# Altium schematic sheet VideoFiltering.SchDoc
size B; SheetNumber: 4; SheetTotal: 8
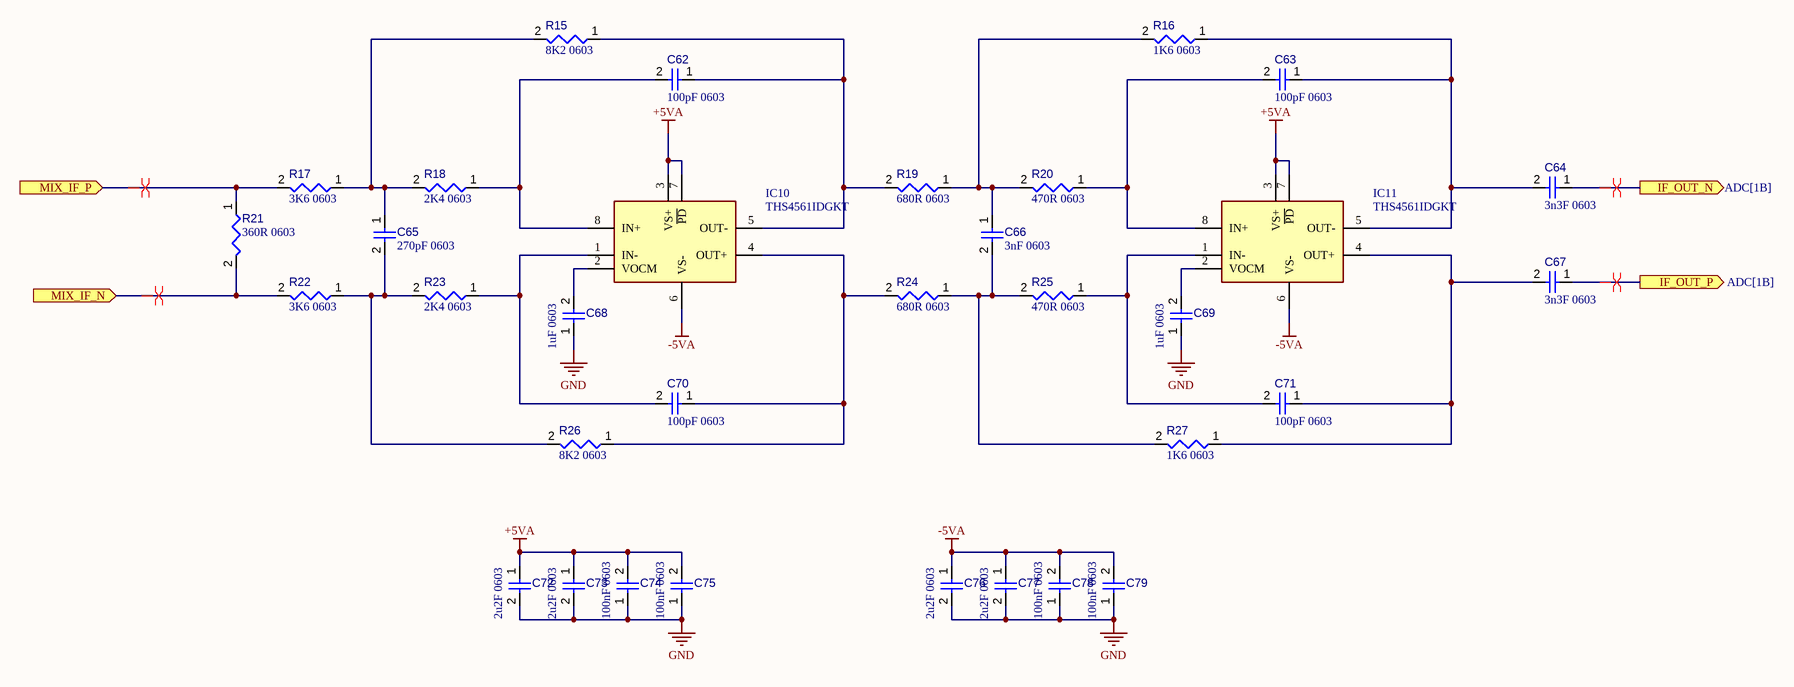
[diagram p0: VideoFiltering.SchDoc]

## Parts
C62  value 100pF 0603  [CAPC0603(1608)100_L]  (hidden comment: Capacitor 1µF +/-0.1% 25V 0603)
C63  value 100pF 0603  [CAPC0603(1608)100_L]  (hidden comment: Capacitor 1µF +/-0.1% 25V 0603)
C64  value 3n3F 0603  [CAPC0603(1608)100_L]  (hidden comment: Capacitor 1µF +/-0.1% 25V 0603)
C65  value 270pF 0603  [CAPC0603(1608)100_L]  (hidden comment: Capacitor 1µF +/-0.1% 25V 0603)
C66  value 3nF 0603  [CAPC0603(1608)100_L]  (hidden comment: Capacitor 1µF +/-0.1% 25V 0603)
C67  value 3n3F 0603  [CAPC0603(1608)100_L]  (hidden comment: Capacitor 1µF +/-0.1% 25V 0603)
C68  value 1uF 0603  [CAPC0603(1608)100_L]  (hidden comment: Capacitor 1µF +/-0.1% 25V 0603)
C69  value 1uF 0603  [CAPC0603(1608)100_L]  (hidden comment: Capacitor 1µF +/-0.1% 25V 0603)
C70  value 100pF 0603  [CAPC0603(1608)100_L]  (hidden comment: Capacitor 1µF +/-0.1% 25V 0603)
C71  value 100pF 0603  [CAPC0603(1608)100_L]  (hidden comment: Capacitor 1µF +/-0.1% 25V 0603)
C72  value 2u2F 0603  [CAPC0603(1608)100_L]  (hidden comment: Capacitor 1µF +/-0.1% 25V 0603)
C73  value 2u2F 0603  [CAPC0603(1608)100_L]  (hidden comment: Capacitor 1µF +/-0.1% 25V 0603)
C74  value 100nF 0603  [CAPC0603(1608)100_L]  (hidden comment: Capacitor 1µF +/-0.1% 25V 0603)
C75  value 100nF 0603  [CAPC0603(1608)100_L]  (hidden comment: Capacitor 1µF +/-0.1% 25V 0603)
C76  value 2u2F 0603  [CAPC0603(1608)100_L]  (hidden comment: Capacitor 1µF +/-0.1% 25V 0603)
C77  value 2u2F 0603  [CAPC0603(1608)100_L]  (hidden comment: Capacitor 1µF +/-0.1% 25V 0603)
C78  value 100nF 0603  [CAPC0603(1608)100_L]  (hidden comment: Capacitor 1µF +/-0.1% 25V 0603)
C79  value 100nF 0603  [CAPC0603(1608)100_L]  (hidden comment: Capacitor 1µF +/-0.1% 25V 0603)
IC10  THS4561IDGKT  [SOP65P490X110-8N]
IC11  THS4561IDGKT  [SOP65P490X110-8N]
R15  value 8K2 0603  [RESC0603(1608)_L]  (hidden comment: 120R3J)
R16  value 1K6 0603  [RESC0603(1608)_L]  (hidden comment: 120R3J)
R17  value 3K6 0603  [RESC0603(1608)_L]  (hidden comment: 120R3J)
R18  value 2K4 0603  [RESC0603(1608)_L]  (hidden comment: 120R3J)
R19  value 680R 0603  [RESC0603(1608)_L]  (hidden comment: 120R3J)
R20  value 470R 0603  [RESC0603(1608)_L]  (hidden comment: 120R3J)
R21  value 360R 0603  [RESC0603(1608)_L]  (hidden comment: 120R3J)
R22  value 3K6 0603  [RESC0603(1608)_L]  (hidden comment: 120R3J)
R23  value 2K4 0603  [RESC0603(1608)_L]  (hidden comment: 120R3J)
R24  value 680R 0603  [RESC0603(1608)_L]  (hidden comment: 120R3J)
R25  value 470R 0603  [RESC0603(1608)_L]  (hidden comment: 120R3J)
R26  value 8K2 0603  [RESC0603(1608)_L]  (hidden comment: 120R3J)
R27  value 1K6 0603  [RESC0603(1608)_L]  (hidden comment: 120R3J)

## Ports
IF_OUT_N (out, see ADC[1B]), IF_OUT_P (out, see ADC[1B]), MIX_IF_N (in, see Mixer[6B]), MIX_IF_P (in, see Mixer[6C])

## Nets
+5VA: C72.1 C73.1 C74.2 C75.2 IC10.3(VS+) IC10.7(~{PD}) IC11.3(VS+) IC11.7(~{PD})
-5VA: C76.1 C77.1 C78.2 C79.2 IC10.6(VS-) IC11.6(VS-)
GND: C68.1 C69.1 C72.2 C73.2 C74.1 C75.1 C76.2 C77.2 C78.1 C79.1
IF_OUT_N: C64.1 ; port IF_OUT_N
IF_OUT_P: C67.1 ; port IF_OUT_P
MIX_IF_N: R21.2 R22.2 ; port MIX_IF_N
MIX_IF_P: R17.2 R21.1 ; port MIX_IF_P
NetC62_1: C62.1 IC10.5(OUT-) R15.1 R19.2
NetC62_2: C62.2 IC10.8(IN+) R18.1
NetC63_1: C63.1 C64.2 IC11.5(OUT-) R16.1
NetC63_2: C63.2 IC11.8(IN+) R20.1
NetC65_1: C65.1 R15.2 R17.1 R18.2
NetC65_2: C65.2 R22.1 R23.2 R26.2
NetC66_1: C66.1 R16.2 R19.1 R20.2
NetC66_2: C66.2 R24.1 R25.2 R27.2
NetC67_2: C67.2 C71.1 IC11.4(OUT+) R27.1
NetC68_2: C68.2 IC10.2(VOCM)
NetC69_2: C69.2 IC11.2(VOCM)
NetC70_1: C70.1 IC10.4(OUT+) R24.2 R26.1
NetC70_2: C70.2 IC10.1(IN-) R23.1
NetC71_2: C71.2 IC11.1(IN-) R25.1

## Layout directives
differential pair: IF_OUT_N, IF_OUT_P, MIX_IF_N, MIX_IF_P

## Library data of the parts
C62 C63 C70 C71 = CMP-001-00055-4: Chip Capacitor, 1µF +/-0.1%, 25V, 0603, Thickness 1 mm; Manufacturer Part No: 06033A101GAT2A; Tolerance: 20%; Min Operating Temperature: -55°C; Max Operating Temperature: 85°C; Voltage Rating: 25V; Mounting Technology: SMT; Case/Package: 0603; Pins: 2; Mouser Part No: 581-06033A101GAT2A
C64 C67 = CMP-001-00055-4: Chip Capacitor, 1µF +/-0.1%, 25V, 0603, Thickness 1 mm; Manufacturer Part No: VJ0603Y332JXBAC; Tolerance: 20%; Min Operating Temperature: -55°C; Max Operating Temperature: 85°C; Voltage Rating: 25V; Mounting Technology: SMT; Case/Package: 0603; Pins: 2; Mouser Part No: 77-VJ0603Y332JXBAC
C65 = CMP-001-00055-4: Chip Capacitor, 1µF +/-0.1%, 25V, 0603, Thickness 1 mm; Manufacturer Part No: C0603C271J1GACAUTO; Tolerance: 20%; Min Operating Temperature: -55°C; Max Operating Temperature: 85°C; Voltage Rating: 25V; Mounting Technology: SMT; Case/Package: 0603; Pins: 2; Mouser Part No: 80-C0603C271J1GAUTO
C66 = CMP-001-00055-4: Chip Capacitor, 1µF +/-0.1%, 25V, 0603, Thickness 1 mm; Manufacturer Part No: C0603C302K5GACTU; Tolerance: 20%; Min Operating Temperature: -55°C; Max Operating Temperature: 85°C; Voltage Rating: 25V; Mounting Technology: SMT; Case/Package: 0603; Pins: 2; Mouser Part No: 80-C0603C302K5G
C68 C69 = CMP-001-00055-4: Chip Capacitor, 1µF +/-0.1%, 25V, 0603, Thickness 1 mm; Manufacturer Part No: 0603YC105KAZ2A; Tolerance: 20%; Min Operating Temperature: -55°C; Max Operating Temperature: 85°C; Voltage Rating: 25V; Mounting Technology: SMT; Case/Package: 0603; Pins: 2; Mouser Part No: 581-0603YC105KAZ2A
C72 C73 C76 C77 = CMP-001-00055-4: Multilayer Ceramic Capacitors MLCC - SMD/SMT 0603 10nF 16volts X7R 10%; Manufacturer Part No: VJ0603G225KXQCW1BC; Tolerance: 20%; Min Operating Temperature: -55°C; Max Operating Temperature: 85°C; Voltage Rating: 25V; Mounting Technology: SMT; Case/Package: 0603; Pins: 2; Mouser Part No: 77-VJ0603G225KXQCWBC
C74 C75 C78 C79 = CMP-001-00055-4: Chip Capacitor, 1µF +/-0.1%, 25V, 0603, Thickness 1 mm; Manufacturer Part No: 0603X104K250CT; Tolerance: 20%; Min Operating Temperature: -55°C; Max Operating Temperature: 85°C; Voltage Rating: 25V; Mounting Technology: SMT; Case/Package: 0603; Pins: 2; Mouser Part No: 791-0603X104K250CT
IC10 IC11 = THS4561IDGKT: Integrated Circuit; Manufacturer_Name: Texas Instruments; Datasheet Link: http://www.ti.com/general/docs/suppproductinfo.tsp?distId=10&gotoUrl=http%3A%2F%2Fwww.ti.com%2Flit%2Fgpn%2Fths4561; Height: 1.1mm; Manufacturer Part No: THS4561IDGKT; Mouser Part No: 595-THS4561IDGKT; Mouser Price/Stock: https://www.mouser.co.uk/ProductDetail/Texas-Instruments/THS4561IDGKT?qs=YCa%2FAAYMW01gTL9xVldK5g%3D%3D
R15 R26 = CMP-009-00069-2: Thick Film Resistors - SMD WRIS-RSKS 100 Ohms 1 % 0.1 W 0603 AEC-Q200; Manufacturer Part No: CR0603-FX-8201ELF; Power: 100mW; Tolerance: 5%; Mounting Technology: SMT; Case/Package: 0603; Pins: 2; Mouser Part No: 652-CR0603FX-8201ELF
R16 R27 = CMP-009-00069-2: Thick Film Resistors - SMD WRIS-RSKS 100 Ohms 1 % 0.1 W 0603 AEC-Q200; Manufacturer Part No: RT0603BRE071K6L; Power: 100mW; Tolerance: 5%; Mounting Technology: SMT; Case/Package: 0603; Pins: 2; Mouser Part No: 603-RT0603BRE071K6L
R17 R22 = CMP-009-00069-2: Thick Film Resistors - SMD WRIS-RSKS 100 Ohms 1 % 0.1 W 0603 AEC-Q200; Manufacturer Part No: CRCW06033K60FKTA; Power: 100mW; Tolerance: 5%; Mounting Technology: SMT; Case/Package: 0603; Pins: 2; Mouser Part No: 71-CRCW0603-3.6K
R18 R23 = CMP-009-00069-2: Thick Film Resistors - SMD WRIS-RSKS 100 Ohms 1 % 0.1 W 0603 AEC-Q200; Manufacturer Part No: RC0603FR-7W2K4L; Power: 100mW; Tolerance: 5%; Mounting Technology: SMT; Case/Package: 0603; Pins: 2; Mouser Part No: 603-RC0603FR-7W2K4L
R19 R24 = CMP-009-00069-2: Thick Film Resistors - SMD WRIS-RSKS 100 Ohms 1 % 0.1 W 0603 AEC-Q200; Manufacturer Part No: CR0603-JW-681ELF; Power: 100mW; Tolerance: 5%; Mounting Technology: SMT; Case/Package: 0603; Pins: 2; Mouser Part No: 652-CR0603JW-681ELF
R20 R25 = CMP-009-00069-2: Thick Film Resistors - SMD WRIS-RSKS 100 Ohms 1 % 0.1 W 0603 AEC-Q200; Manufacturer Part No: CR0603-JW-471ELF; Power: 100mW; Tolerance: 5%; Mounting Technology: SMT; Case/Package: 0603; Pins: 2; Mouser Part No: 652-CR0603JW-471ELF
R21 = CMP-009-00069-2: Thick Film Resistors - SMD WRIS-RSKS 100 Ohms 1 % 0.1 W 0603 AEC-Q200; Manufacturer Part No: CR0603-JW-361ELF; Power: 100mW; Tolerance: 5%; Mounting Technology: SMT; Case/Package: 0603; Pins: 2; Mouser Part No: 652-CR0603JW-361ELF